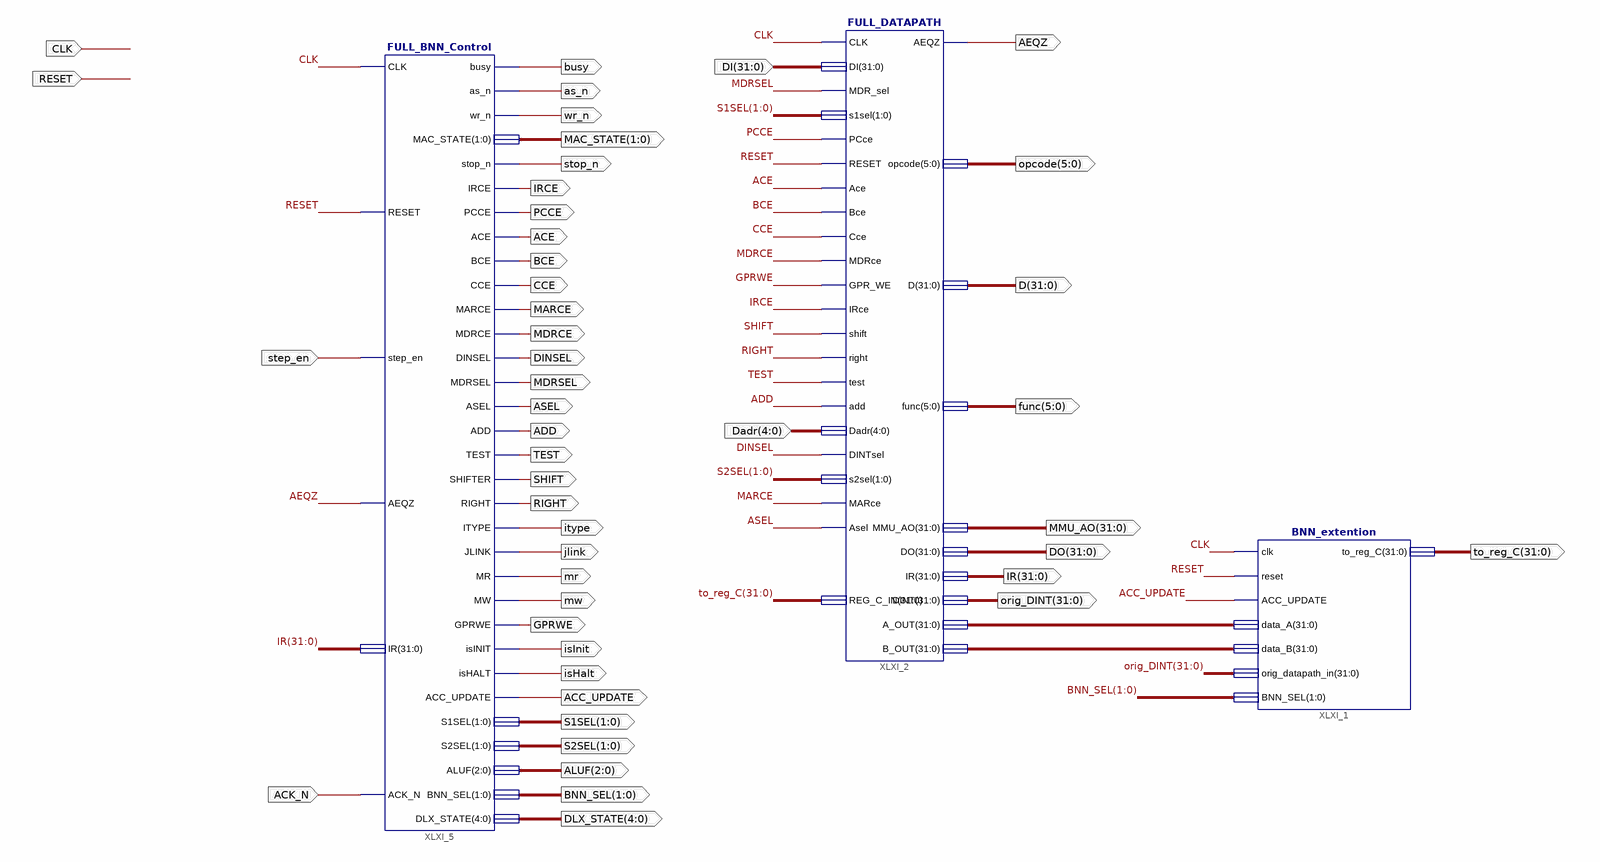
[diagram p0: schematic sheet 1]
// Xilinx ISE schematic FULL_Extended_DLX.sch (spartan6) as structural Verilog: 3 symbols, 47 ports
module FULL_Extended_DLX (
  input  CLK,
  input  RESET,
  input  step_en,
  input  ACK_N,
  input  [31:0] DI,
  input  [4:0] Dadr,
  output AEQZ,
  output [31:0] IR,
  output ACC_UPDATE,
  output [1:0] BNN_SEL,
  output [31:0] DO,
  output [31:0] MMU_AO,
  output [5:0] func,
  output [31:0] D,
  output [5:0] opcode,
  output itype,
  output jlink,
  output mr,
  output mw,
  output isInit,
  output isHalt,
  output [2:0] ALUF,
  output [4:0] DLX_STATE,
  output busy,
  output as_n,
  output wr_n,
  output [1:0] MAC_STATE,
  output stop_n,
  output IRCE,
  output PCCE,
  output ACE,
  output BCE,
  output CCE,
  output MARCE,
  output MDRCE,
  output DINSEL,
  output MDRSEL,
  output ASEL,
  output ADD,
  output TEST,
  output SHIFT,
  output RIGHT,
  output GPRWE,
  output [1:0] S1SEL,
  output [1:0] S2SEL,
  output [31:0] to_reg_C,
  output [31:0] orig_DINT
);

  wire [31:0] XLXN_38, XLXN_39;

  FULL_DATAPATH XLXI_2 (
    .CLK(CLK), .DI(DI), .MDR_sel(MDRSEL), .s1sel(S1SEL), .PCce(PCCE), .RESET(RESET), .Ace(ACE), .Bce(BCE),
    .MDRce(MDRCE), .GPR_WE(GPRWE), .IRce(IRCE), .shift(SHIFT), .right(RIGHT), .test(TEST), .add(ADD),
    .Dadr(Dadr), .DINTsel(DINSEL), .s2sel(S2SEL), .MARce(MARCE), .Asel(ASEL), .Cce(CCE), .REG_C_IN(to_reg_C),
    .DINT(orig_DINT), .AEQZ(AEQZ), .opcode(opcode), .D(D), .func(func), .MMU_AO(MMU_AO), .DO(DO),
    .A_OUT(XLXN_38), .B_OUT(XLXN_39), .IR(IR));
  FULL_BNN_Control XLXI_5 (
    .CLK(CLK), .RESET(RESET), .step_en(step_en), .AEQZ(AEQZ), .IR(IR), .ACK_N(ACK_N), .busy(busy),
    .as_n(as_n), .wr_n(wr_n), .MAC_STATE(MAC_STATE), .stop_n(stop_n), .IRCE(IRCE), .PCCE(PCCE), .ACE(ACE),
    .BCE(BCE), .CCE(CCE), .MARCE(MARCE), .MDRCE(MDRCE), .DINSEL(DINSEL), .MDRSEL(MDRSEL), .ASEL(ASEL),
    .ADD(ADD), .TEST(TEST), .SHIFTER(SHIFT), .RIGHT(RIGHT), .ITYPE(itype), .JLINK(jlink), .MR(mr), .MW(mw),
    .GPRWE(GPRWE), .isINIT(isInit), .isHALT(isHalt), .ACC_UPDATE(ACC_UPDATE), .S1SEL(S1SEL), .S2SEL(S2SEL),
    .ALUF(ALUF), .BNN_SEL(BNN_SEL), .DLX_STATE(DLX_STATE));
  BNN_extention XLXI_1 (
    .clk(CLK), .reset(RESET), .ACC_UPDATE(ACC_UPDATE), .data_A(XLXN_38), .data_B(XLXN_39),
    .orig_datapath_in(orig_DINT), .BNN_SEL(BNN_SEL), .to_reg_C(to_reg_C));
endmodule
